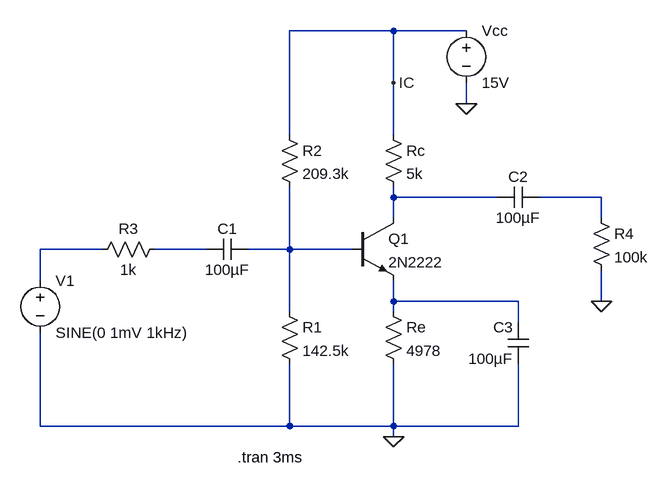
[diagram p0: schematic CommonEmitter.asc]
CommonEmitter.asc, the LTspice schematic file:
Version 4
SHEET 1 880 680
WIRE 320 -224 160 -224
WIRE 432 -224 320 -224
WIRE 320 -144 320 -224
WIRE 432 -112 432 -144
WIRE 160 -64 160 -224
WIRE 320 -64 320 -144
WIRE 320 32 320 16
WIRE 480 32 320 32
WIRE 640 32 544 32
WIRE 320 64 320 32
WIRE 640 64 640 32
WIRE -128 112 -224 112
WIRE 32 112 -48 112
WIRE 160 112 160 16
WIRE 160 112 96 112
WIRE 256 112 160 112
WIRE -224 160 -224 112
WIRE 320 192 320 160
WIRE 512 192 320 192
WIRE 640 192 640 144
WIRE 160 208 160 112
WIRE 320 208 320 192
WIRE 512 224 512 192
WIRE -224 384 -224 240
WIRE 160 384 160 288
WIRE 160 384 -224 384
WIRE 320 384 320 288
WIRE 320 384 160 384
WIRE 512 384 512 288
WIRE 512 384 320 384
WIRE 320 400 320 384
FLAG 432 -112 0
FLAG 640 192 0
FLAG 320 400 0
FLAG 320 -144 IC
SYMBOL res 144 192 R0
SYMATTR InstName R1
SYMATTR Value 142.5k
SYMBOL res 144 -80 R0
SYMATTR InstName R2
SYMATTR Value 209.3k
SYMBOL res 304 192 R0
SYMATTR InstName Re
SYMATTR Value 4978
SYMBOL res 304 -80 R0
SYMATTR InstName Rc
SYMATTR Value 5k
SYMBOL npn 256 64 R0
SYMATTR InstName Q1
SYMATTR Value 2N2222
SYMBOL voltage 432 -240 R0
SYMATTR InstName Vcc
SYMATTR Value 15V
SYMBOL voltage -224 144 R0
WINDOW 123 0 0 Left 0
WINDOW 39 0 0 Left 0
SYMATTR InstName V1
SYMATTR Value SINE(0 1mV 1kHz)
SYMBOL cap 544 16 R90
WINDOW 0 0 32 VBottom 2
WINDOW 3 32 32 VTop 2
SYMATTR InstName C2
SYMATTR Value 100µF
SYMBOL cap 528 288 R180
WINDOW 0 24 56 Left 2
WINDOW 3 24 8 Left 2
SYMATTR InstName C3
SYMATTR Value 100µF
SYMBOL res 624 48 R0
SYMATTR InstName R4
SYMATTR Value 100k
SYMBOL cap 96 96 R90
WINDOW 0 0 32 VBottom 2
WINDOW 3 32 32 VTop 2
SYMATTR InstName C1
SYMATTR Value 100µF
SYMBOL res -32 96 R90
WINDOW 0 0 56 VBottom 2
WINDOW 3 32 56 VTop 2
SYMATTR InstName R3
SYMATTR Value 1k
TEXT 80 432 Left 2 !.tran 3ms

The netlist it stands for:
* CommonEmitter.asc
R1 N005 0 142.5k
R2 IC N005 209.3k
Re N006 0 4978
Rc IC N001 5k
Q1 N001 N005 N006 0 2N2222
Vcc IC 0 15V
V1 N003 0 SINE(0 1mV 1kHz)
C2 N002 N001 100µF
C3 0 N006 100µF
R4 N002 0 100k
C1 N005 N004 100µF
R3 N004 N003 1k
.model NPN NPN
.model PNP PNP
.lib standard.bjt
.tran 3ms
.backanno
.end